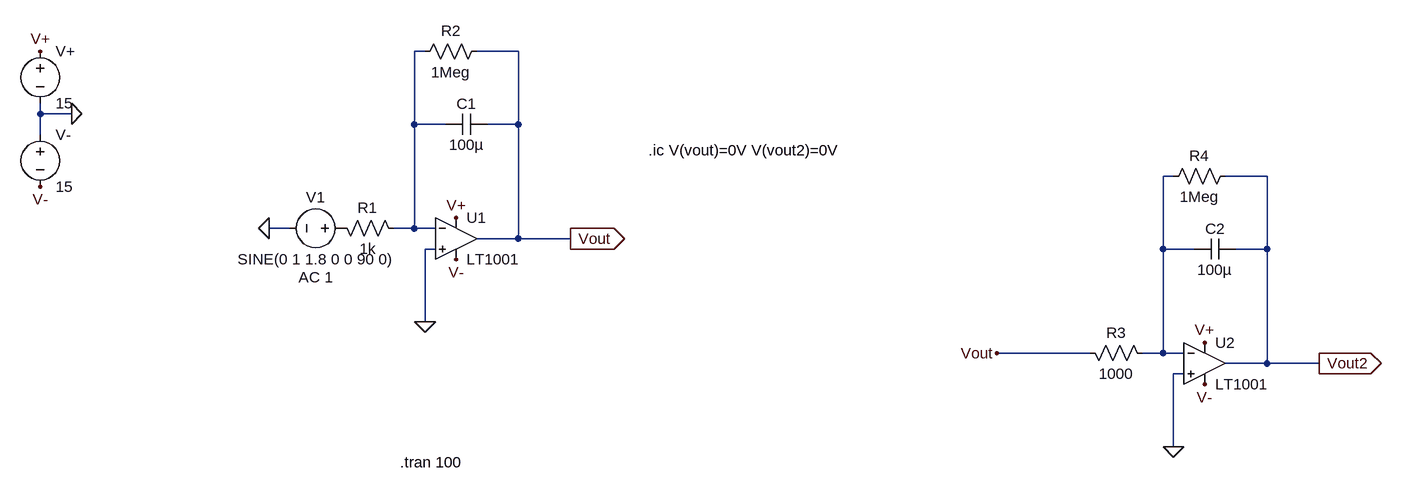
[diagram p0: schematic Integrator_Amplifier.asc]
Integrator_Amplifier.asc, the LTspice schematic file:
Version 4
SHEET 1 1376 680
WIRE -128 -304 -144 -304
WIRE 16 -304 -48 -304
WIRE -720 -208 -720 -224
WIRE -672 -208 -720 -208
WIRE -144 -192 -144 -304
WIRE -96 -192 -144 -192
WIRE 16 -192 16 -304
WIRE 16 -192 -32 -192
WIRE -720 -176 -720 -208
WIRE 1024 -112 1008 -112
WIRE 1168 -112 1104 -112
WIRE -336 -32 -368 -32
WIRE -144 -32 -144 -192
WIRE -144 -32 -176 -32
WIRE -112 -32 -144 -32
WIRE 16 -16 16 -192
WIRE 16 -16 -48 -16
WIRE 96 -16 16 -16
WIRE -112 0 -128 0
WIRE 1008 0 1008 -112
WIRE 1056 0 1008 0
WIRE 1168 0 1168 -112
WIRE 1168 0 1120 0
WIRE -128 112 -128 0
WIRE 896 160 752 160
WIRE 1008 160 1008 0
WIRE 1008 160 976 160
WIRE 1040 160 1008 160
WIRE 1168 176 1168 0
WIRE 1168 176 1104 176
WIRE 1248 176 1168 176
WIRE 1040 192 1024 192
WIRE 1024 304 1024 192
FLAG -368 -32 0
FLAG -672 -208 0
FLAG -720 -304 V+
FLAG -720 -96 V-
FLAG -80 -48 V+
FLAG -80 16 V-
FLAG 96 -16 Vout
IOPIN 96 -16 Out
FLAG -128 112 0
FLAG 1072 144 V+
FLAG 1072 208 V-
FLAG 1248 176 Vout2
IOPIN 1248 176 Out
FLAG 1024 304 0
FLAG 752 160 Vout
SYMBOL OpAmps\\LT1001 -80 -80 R0
SYMATTR InstName U1
SYMBOL res -272 -48 M90
WINDOW 0 0 56 VBottom 2
WINDOW 3 32 56 VTop 2
SYMATTR InstName R1
SYMATTR Value 1k
SYMBOL voltage -240 -32 R90
WINDOW 0 -32 56 VBottom 2
WINDOW 3 32 56 VTop 2
WINDOW 123 60 56 VTop 2
WINDOW 39 0 0 Left 0
SYMATTR InstName V1
SYMATTR Value SINE(0 1 1.8 0 0 90 0)
SYMATTR Value2 AC 1
SYMBOL voltage -720 -320 R0
WINDOW 123 0 0 Left 0
WINDOW 39 0 0 Left 0
SYMATTR InstName V+
SYMATTR Value 15
SYMBOL voltage -720 -192 R0
WINDOW 123 0 0 Left 0
WINDOW 39 0 0 Left 0
SYMATTR InstName V-
SYMATTR Value 15
SYMBOL cap -32 -208 R90
WINDOW 0 0 32 VBottom 2
WINDOW 3 32 32 VTop 2
SYMATTR InstName C1
SYMATTR Value 100µ
SYMBOL res -32 -320 R90
WINDOW 0 0 56 VBottom 2
WINDOW 3 32 56 VTop 2
SYMATTR InstName R2
SYMATTR Value 1Meg
SYMBOL OpAmps\\LT1001 1072 112 R0
SYMATTR InstName U2
SYMBOL res 880 144 M90
WINDOW 0 0 56 VBottom 2
WINDOW 3 32 56 VTop 2
SYMATTR InstName R3
SYMATTR Value 1000
SYMBOL cap 1120 -16 R90
WINDOW 0 0 32 VBottom 2
WINDOW 3 32 32 VTop 2
SYMATTR InstName C2
SYMATTR Value 100µ
SYMBOL res 1120 -128 R90
WINDOW 0 0 56 VBottom 2
WINDOW 3 32 56 VTop 2
SYMATTR InstName R4
SYMATTR Value 1Meg
TEXT -166 328 Left 2 !.tran 100
TEXT 216 -152 Left 2 !.ic V(vout)=0V V(vout2)=0V

The netlist it stands for:
* Integrator_Amplifier.asc
XU1 0 N001 V+ V- Vout LT1001  ; pins In+ In- V+ V- OUT
R1 P001 N001 1k
V1 P001 0 SINE(0 1 1.8 0 0 90 0) AC 1
V+ V+ 0 15
V- 0 V- 15
C1 Vout N001 100µ
R2 Vout N001 1Meg
XU2 0 N002 V+ V- Vout2 LT1001  ; pins In+ In- V+ V- OUT
R3 Vout N002 1000
C2 Vout2 N002 100µ
R4 Vout2 N002 1Meg
.tran 100
.ic V(vout)=0V V(vout2)=0V
.lib LTC.lib
.backanno
.end